# EAGLE schematic connection_schema (EAGLE 9.3.2)
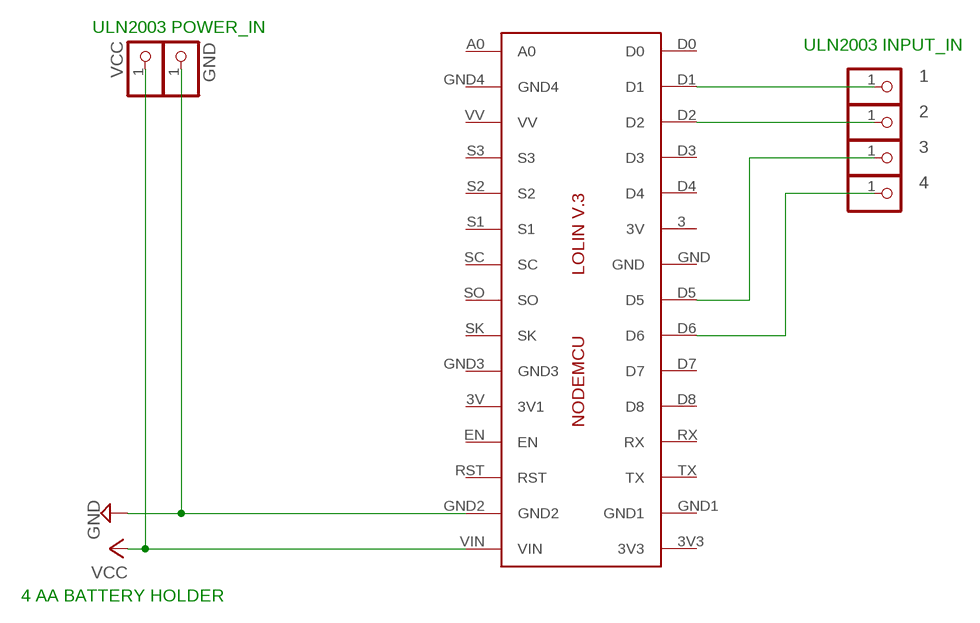
[diagram p0: schematic, sheet 1]

## Parts
1  PINHD-1X1  [1X01]
2  PINHD-1X1  [1X01]
3  PINHD-1X1  [1X01]
4  PINHD-1X1  [1X01]
GND  PINHD-1X1  [1X01]
IC1  LOLINV3  [LOLINV3]
VCC  PINHD-1X1  [1X01]

## Nets
GND: GND.1 IC1.GND2
N$1: 1.1 IC1.D1
N$2: 2.1 IC1.D2
N$3: 3.1 IC1.D5
N$4: 4.1 IC1.D6
VCC: IC1.VIN VCC.1
Unconnected: IC1.3(3V) IC1.3V3 IC1.3V(3V1) IC1.A0 IC1.D0 IC1.D3 IC1.D4 IC1.D7 IC1.D8 IC1.EN IC1.GND IC1.GND1 IC1.GND3 IC1.GND4 IC1.RST IC1.RX IC1.S1 IC1.S2 IC1.S3 IC1.SC IC1.SK IC1.SO IC1.TX IC1.VV

## Notes on the sheet
- ULN2003 POWER_IN
- ULN2003 INPUT_IN
- 4 AA BATTERY HOLDER

## Library data of the parts
1-4 GND VCC = pinhead:PINHD-1X1: PIN HEADER
IC1 = Lolin:LOLINV3